# EAGLE design EXM Relay Three - Rev A2 (EAGLE 7.7.0)
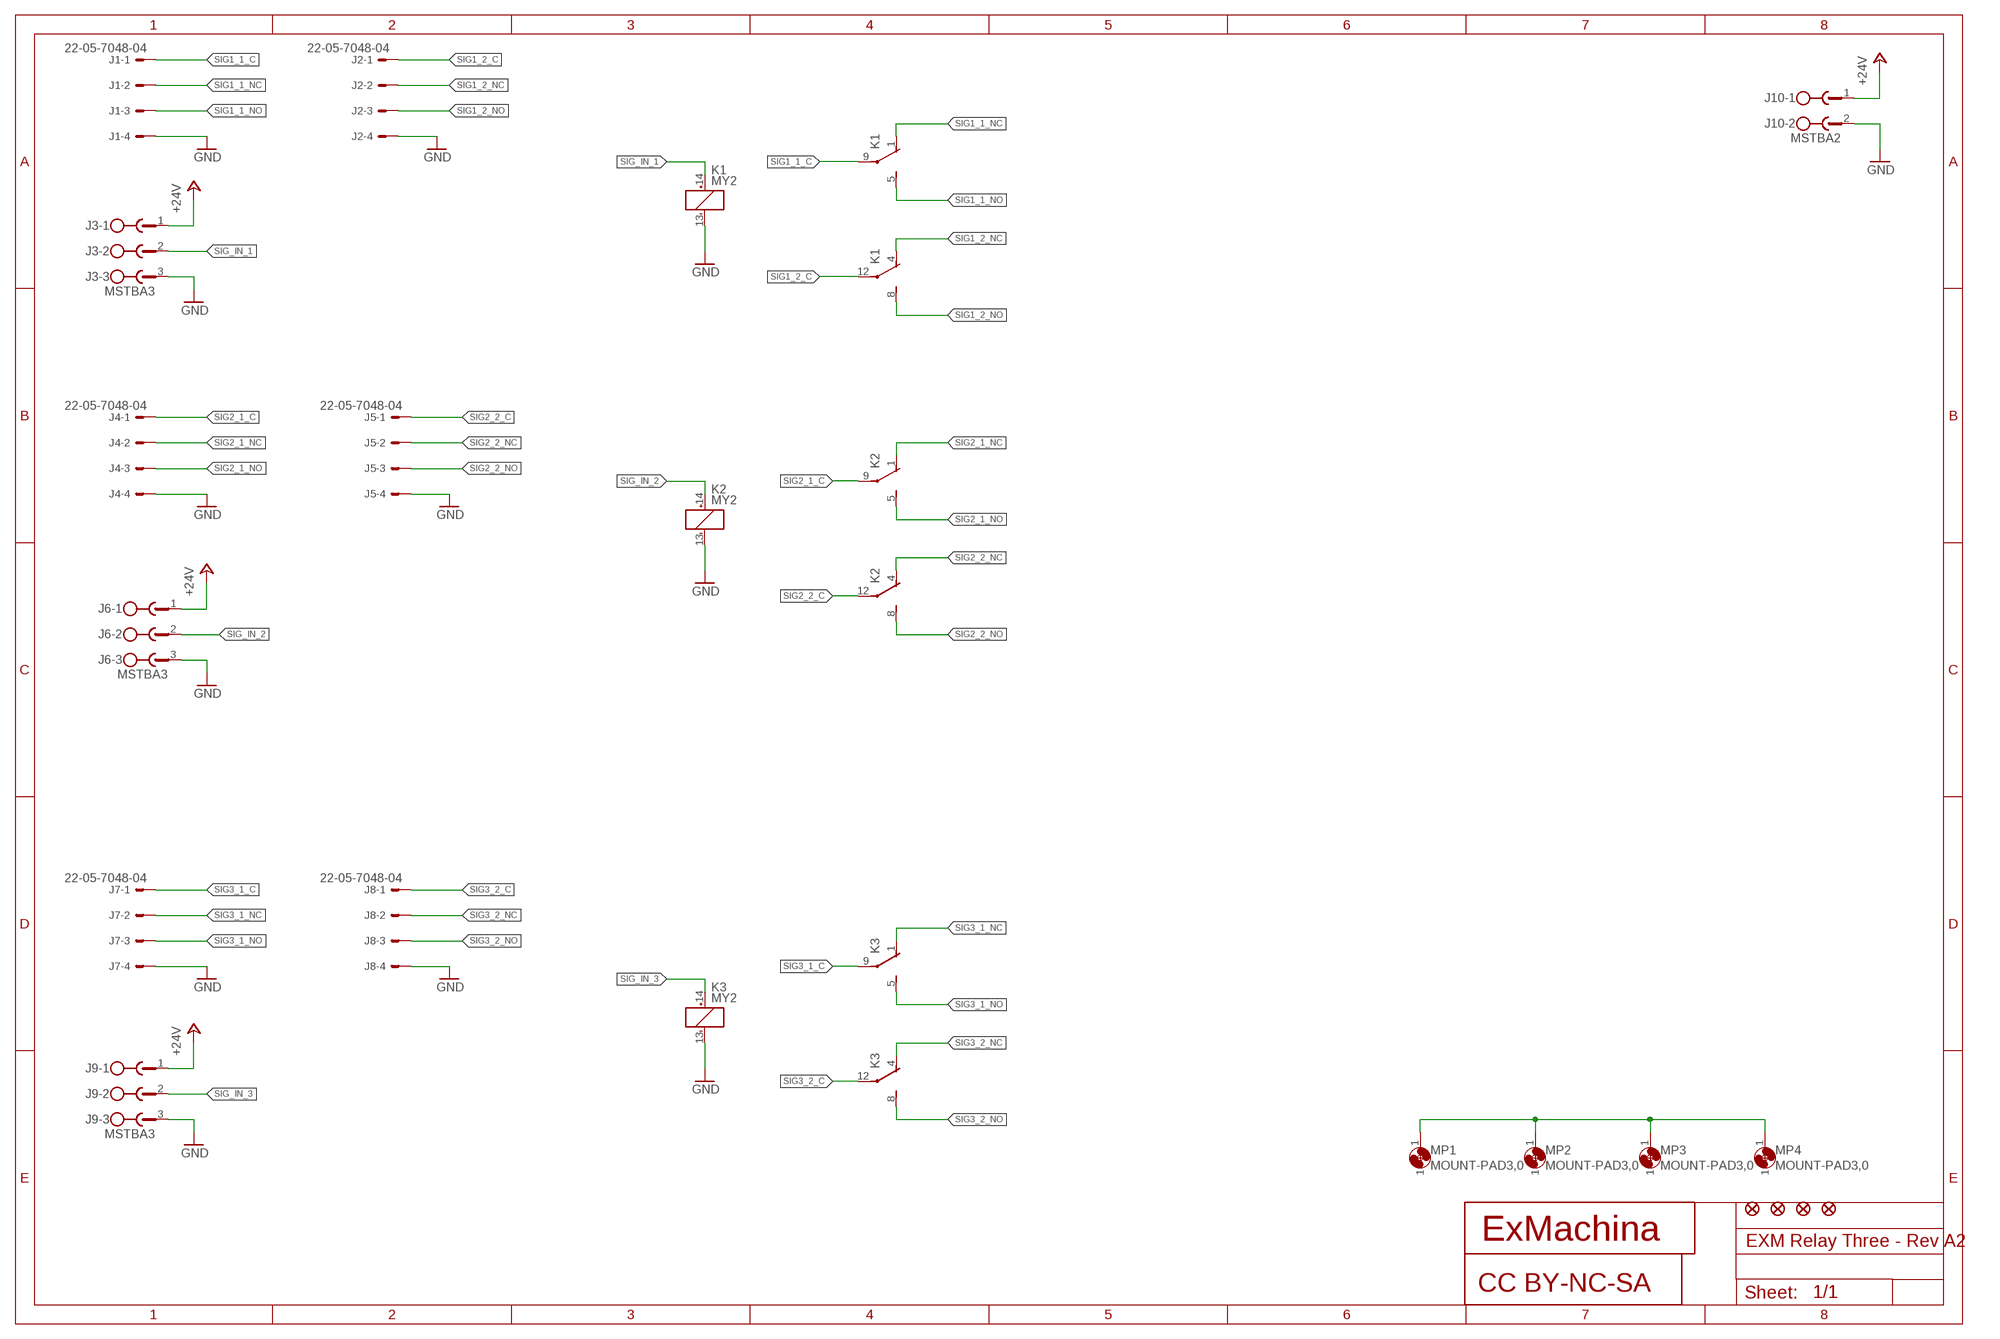
[diagram p0: schematic, sheet 1]

## Parts
CC1  CC-BY-NC-SA  [CC-BY-NC-SA]
J1  22-05-7048-04  [7395-04]
J2  22-05-7048-04  [7395-04]
J3  MSTBA3  [MSTBA3]
J4  22-05-7048-04  [7395-04]
J5  22-05-7048-04  [7395-04]
J6  MSTBA3  [MSTBA3]
J7  22-05-7048-04  [7395-04]
J8  22-05-7048-04  [7395-04]
J9  MSTBA3  [MSTBA3]
J10  MSTBA2  [MSTBA2]
JP1  FIDUCIAL1X2  [FIDUCIAL-1X2]
JP2  FIDUCIAL1X2  [FIDUCIAL-1X2]
JP3  FIDUCIAL1X2  [FIDUCIAL-1X2]
JP4  FIDUCIAL1X2  [FIDUCIAL-1X2]
K1  MY2  [PY08]
K2  MY2  [PY08]
K3  MY2  [PY08]
MP1  MOUNT-PAD3,0  [P3,0]
MP2  MOUNT-PAD3,0  [P3,0]
MP3  MOUNT-PAD3,0  [P3,0]
MP4  MOUNT-PAD3,0  [P3,0]
T1  EXMACHINA-LOGO-NAME  [EXM-LOGO-BASELINE]

## Nets
1: MP1.1 MP2.1 MP3.1 MP4.1
+24V: J3.1 J6.1 J9.1 J10.1
GND: J1.4 J2.4 J3.3 J4.4 J5.4 J6.3 J7.4 J8.4 J9.3 J10.2 K1.13(-) K2.13(-) K3.13(-)
SIG1_1_C: J1.1 K1.9(C)
SIG1_1_NC: J1.2 K1.1(NC)
SIG1_1_NO: J1.3 K1.5(NO)
SIG1_2_C: J2.1 K1.12(C)
SIG1_2_NC: J2.2 K1.4(NC)
SIG1_2_NO: J2.3 K1.8(NO)
SIG2_1_C: J4.1 K2.9(C)
SIG2_1_NC: J4.2 K2.1(NC)
SIG2_1_NO: J4.3 K2.5(NO)
SIG2_2_C: J5.1 K2.12(C)
SIG2_2_NC: J5.2 K2.4(NC)
SIG2_2_NO: J5.3 K2.8(NO)
SIG3_1_C: J7.1 K3.9(C)
SIG3_1_NC: J7.2 K3.1(NC)
SIG3_1_NO: J7.3 K3.5(NO)
SIG3_2_C: J8.1 K3.12(C)
SIG3_2_NC: J8.2 K3.4(NC)
SIG3_2_NO: J8.3 K3.8(NO)
SIG_IN_1: J3.2 K1.14(+)
SIG_IN_2: J6.2 K2.14(+)
SIG_IN_3: J9.2 K3.14(+)

## Library data of the parts
CC1 = cc-by-sa:CC-BY-NC-SA; OC_NEWARK: unknown
J1 J2 J4 J5 J7 J8 = con-molex:22-?-04: CONNECTOR wire to board 2.54 mm (.1 inch) pitch header; OC_FARNELL: unknown; OC_NEWARK: unknown
J3 J6 J9 = con-phoenix-508:MSTBA3: PHOENIX; MF: FARNELL; MPN: 1757255; OC_FARNELL: 3705183; OC_NEWARK: 71C4162
J10 = con-phoenix-508:MSTBA2: PHOENIX; MF: FARNELL; MPN: 1757242; OC_FARNELL: 3705171; OC_NEWARK: 71C4161
JP1-JP4 = SparkFun:FIDUCIAL: Fiducial Alignment Points Various fiducial points for machine vision alignment.; OC_NEWARK: unknown
K1-K3 = rel-omron:MY2; MF: OMRON COMPONENTS USA; MPN: PY08; OC_NEWARK: 36K3464
MP1-MP4 = holes:MOUNT-PAD: MOUNTING HOLE with drill center marker; OC_NEWARK: unknown
T1 = exmachina:EXMACHINA-LOGO; OC_NEWARK: unknown

## Net classes
0 default: width 0.813 mm

## Board
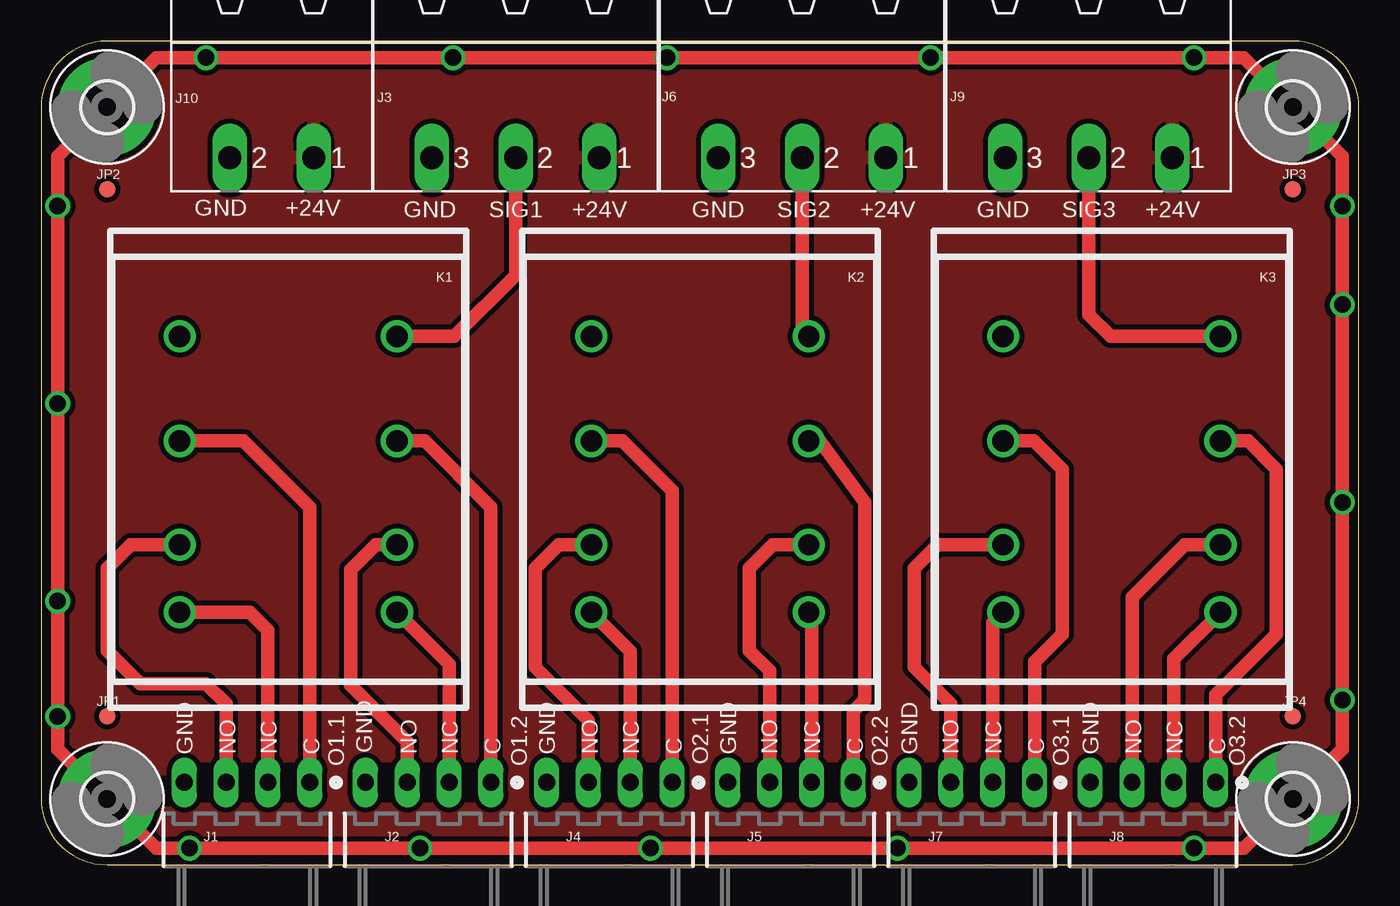
[diagram p1: board, top side]
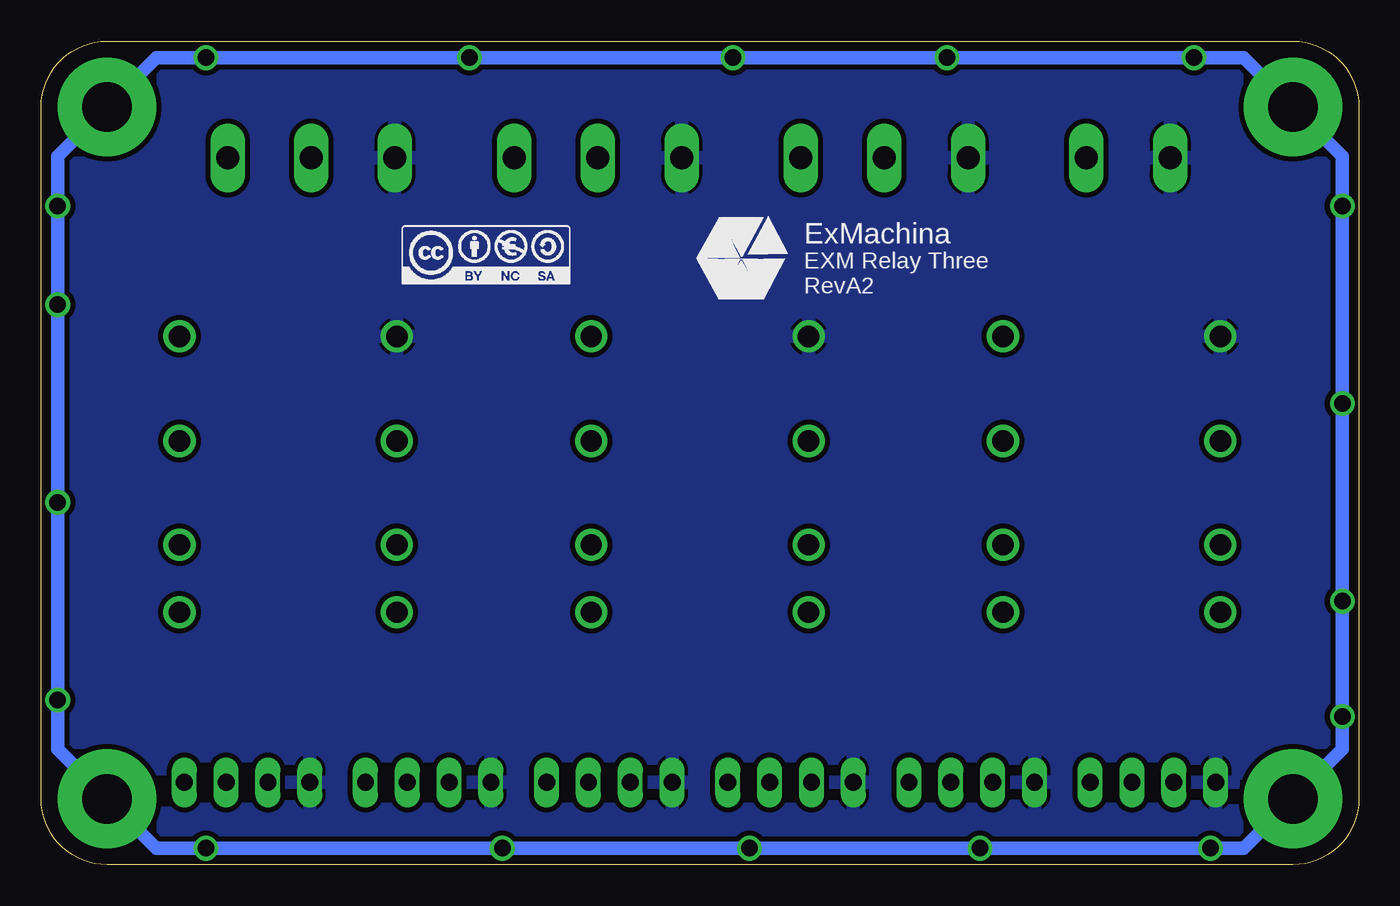
[diagram p2: board, bottom side, seen from below]

Size 80 x 50 mm. Coordinates in mm from the lower left corner, seen from the top.
Outline: 0,46 0,4 arc90 4,0 76,0 arc90 80,4 80,46 arc90 76,50 4,50 arc90 0,46
Copper layers (1*16): Top 0.105mm / dielectric 1.55mm / Bottom 0.105mm
Design rules "eC_2Layer_PClass3_BaseCopperO105": minimum track width 0.25mm, minimum drill 0.35mm, track to track 0.3mm, track to pad 0.3mm, pad to pad 0.3mm, via to via 0.3mm, smd to smd 0mil, copper to edge 0.25mm, drill to drill 0.35mm, minimum pad ring 0.25mm, minimum via ring 0.2mm, stop-mask expansion 0mil, vias tented up to drill 0.45mm, thermal gap 0.2mm

### Footprints (pad centres in the part's own frame; a part is rotated, then mirrored left to right if it is on the bottom)
7395-04 = drill 1.016 long: 1 3.81,0; 2 1.27,0; 3 -1.27,0; 4 -3.81,0
MSTBA3 = drill 1.397 long: 1 -5.08,5.08; 2 0,5.08; 3 5.08,5.08
MSTBA2 = drill 1.397 long: 1 -2.54,5.08; 2 2.54,5.08
FIDUCIAL-1X2 = smd 1 x 1: 1 0,0
PY08 = drill 1.3: 1 6.595,8.675; 4 -6.605,8.675; 5 6.595,4.575; 8 -6.605,4.575; 9 6.595,-1.725; 12 -6.605,-1.725; 13 6.595,-8.075; 14 -6.605,-8.075
P3,0 = drill 3 pad 6: 1 0,0

### Placement (x,y rotation side)
CC1  53,37 0 bottom
J1  12.5,5 0 top
J2  23.5,5 0 top
J3  28.8,48 180 top
J4  34.5,5 0 top
J5  45.5,5 0 top
J6  46.2,48 180 top
J7  56.5,5 0 top
J8  67.5,5 0 top
J9  63.6,48 180 top
J10  14,48 180 top
JP1  4,9 0 top
JP2  4,41 0 top
JP3  76,41 0 top
JP4  76,9 0 top
K1  15,24 180 top
K2  40,24 180 top
K3  65,24 180 top
MP1  76,4 0 top
MP2  4,46 0 top
MP3  76,46 0 top
MP4  4,4 0 top
T1  37.5,36.8 0 bottom
U$1  [A4L-LOC]  -87,-63 0 top  (outside the outline)

### Tracks (layer width: path | path; a pad name or v marks a point on that pad's centre or on a via)
1  (via drill 1)
  Top 0.813: 1,43 v1,40 v1,28 v1,16 v1,9 1,7 MP4.1 7,1 v9,1 v23,1 v37,1 v52,1 v70,1 73,1 MP1.1 79,7 v79,10 v79,22 v79,34 v79,40 79,43 MP3.1 73,49 v70,49 v54,49 v38,49 v25,49 v10,49 7,49 MP2.1 1,43
  Bottom 0.813: MP2.1 7,49 | 7,49 v10,49 | v10,49 v25,49 | v25,49 v38,49 | v38,49 v54,49 | v54,49 v70,49 | v70,49 73,49 | 73,49 MP3.1 | MP3.1 79,43 | 79,43 v79,40 | v79,40 v79,34 | v79,34 v79,22 | v79,22 v79,10 | v79,10 79,7 | 79,7 MP1.1 | MP2.1 1,43 | 1,43 v1,40 | v1,40 v1,28 | v1,28 v1,16 | v1,16 v1,9 | v1,9 1,7 | 7,1 v9,1 | v9,1 v23,1 | v23,1 v37,1 | v37,1 v52,1 | v52,1 v70,1 | v70,1 73,1 | 73,1 MP1.1 | 1,7 MP4.1 | 7,1 MP4.1 | 1,43 v1,40 | v1,40 v1,28 | v1,28 v1,16 | v1,16 v1,9 | v1,9 1,7 | 1,7 MP4.1 | 7,1 MP4.1 | 7,1 v9,1 | v9,1 v23,1 | v23,1 v37,1 | v37,1 v52,1 | v52,1 v70,1 | v70,1 73,1 | 73,1 MP1.1 | 73,1 MP1.1 | 79,7 MP1.1 | 79,43 v79,40 | v79,40 v79,34 | v79,34 v79,22 | v79,22 v79,10 | v79,10 79,7 | MP3.1 79,43 | MP3.1 79,43 | MP3.1 79,43 | 73,49 MP3.1 | 7,49 v10,49 | v10,49 v25,49 | v25,49 v38,49 | v38,49 v54,49 | v54,49 v70,49 | v70,49 73,49 | MP2.1 1,43 | MP2.1 7,49
+24V
  pour Top (isolate 0.305): 101,-9 -17,-9 -17,57 101,57
GND
  pour Bottom (isolate 0.305): 99,-7 -15,-7 -15,56 99,56
SIG1_1_C
  Top 0.813: J1.1 16.31,21.69 12.28,25.73 K1.9
SIG1_1_NC
  Top 0.813: K1.1 12.68,15.32 13.77,14.23 J1.2
SIG1_1_NO
  Top 0.813: K1.5 5.42,19.43 4,18 4,13 6,11 10,11 11.23,9.77 J1.3
SIG1_2_C
  Top 0.813: J2.1 27.31,21.69 23.27,25.73 K1.12
SIG1_2_NC
  Top 0.813: K1.4 24.77,12.16 J2.2
SIG1_2_NO
  Top 0.813: K1.8 20.32,19.43 18.8,17.9 18.8,10.9 22.23,7.47 J2.3
SIG2_1_C
  Top 0.813: J4.1 38.31,22.69 35.27,25.73 K2.9
SIG2_1_NC
  Top 0.813: K2.1 35.77,12.96 J4.2
SIG2_1_NO
  Top 0.813: K2.5 31.43,19.43 30,18 30,12 33.23,8.77 J4.3
SIG2_2_C
  Top 0.813: J5.1 49.31,9.31 50,10 50,22 47.27,25.73 K2.12
SIG2_2_NC
  Top 0.813: J5.2 46.77,15.16 K2.4
SIG2_2_NO
  Top 0.813: K2.8 44.42,19.43 43,18 43,13 44.23,11.77 J5.3
SIG3_1_C
  Top 0.813: J7.1 60.31,12.31 62,14 62,24 60.27,25.73 K3.9
SIG3_1_NC
  Top 0.813: J7.2 57.77,14.69 K3.1
SIG3_1_NO
  Top 0.813: K3.5 54.42,19.43 53,18 53,12 55.23,9.77 J7.3
SIG3_2_C
  Top 0.813: J8.1 71.31,10.31 75,14 75,24 73.28,25.73 K3.12
SIG3_2_NC
  Top 0.813: J8.2 68.77,12.49 K3.4
SIG3_2_NO
  Top 0.813: K3.8 69.42,19.43 66.23,16.23 J8.3
SIG_IN_1
  Top 0.813: K1.14 25.07,32.08 28.8,35.8 J3.2
SIG_IN_2
  Top 0.813: K2.14 46.2,32.48 J6.2
SIG_IN_3
  Top 0.813: K3.14 64.92,32.08 63.6,33.4 J9.2

### Text on the board
tPlace: GND | +24V | GND | SIG1 | +24V | GND | SIG2 | +24V | GND | SIG3 | +24V | GND | NO | NC | C | GND | NO | NC | C | GND | NO | NC | C | GND | NO | NC | C | GND | NO | NC | C | GND | NO | NC | C | O1.1 | O1.2 | O2.1 | O2.2 | O3.1 | O3.2
bPlace: EXM Relay Three / RevA2